# EAGLE design Main (EAGLE 9.5.1)

## Sheet 1 of 2
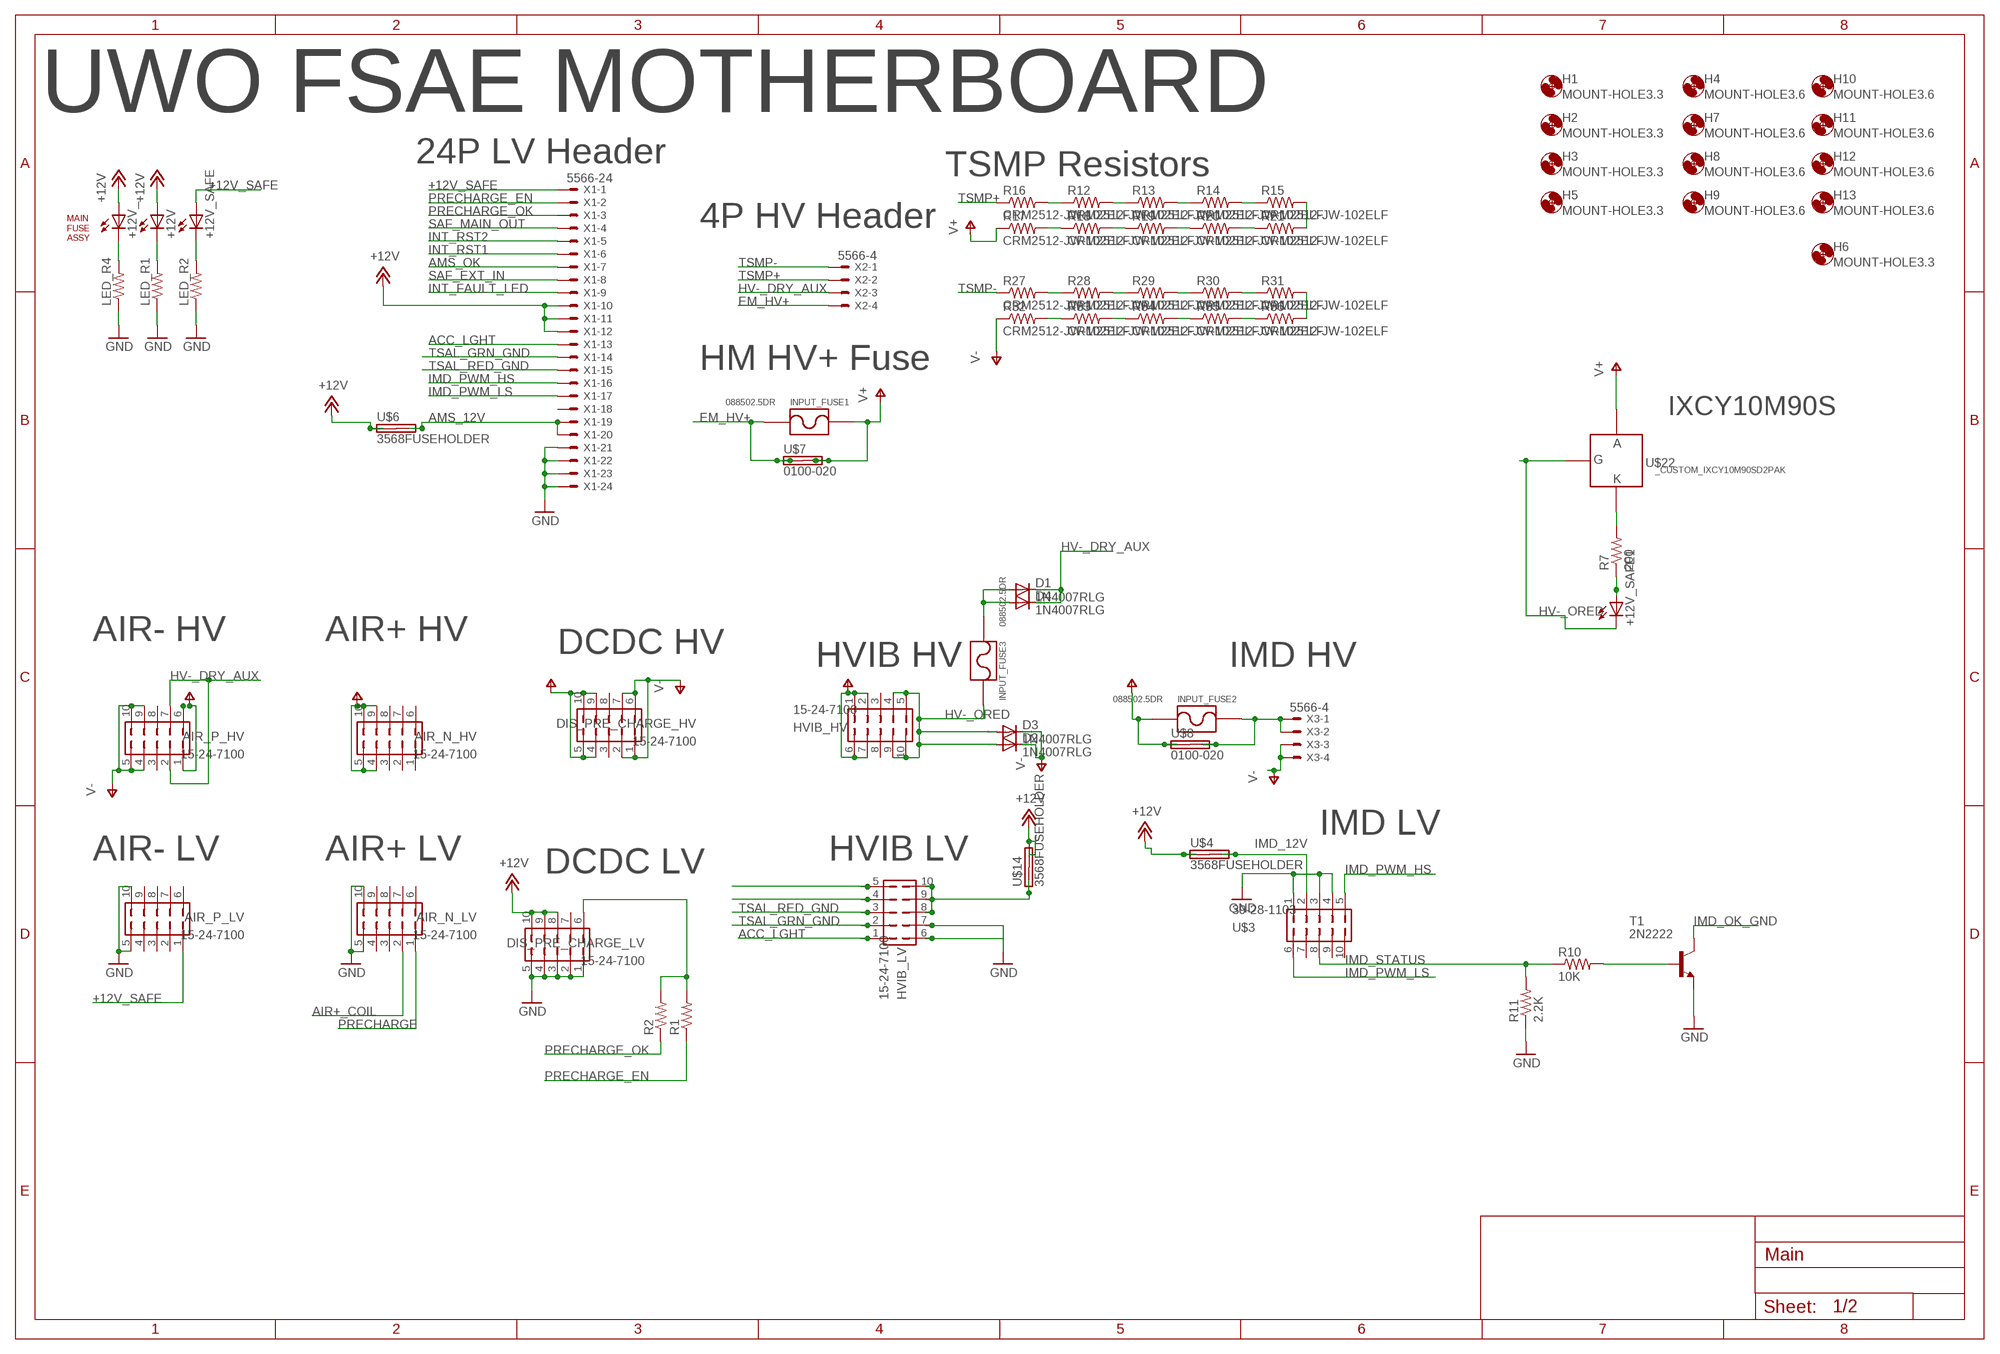
[diagram p0: schematic, sheet 1]

### Parts
+12V  LEDCHIP-LED0805  [CHIP-LED0805]
+12V_  LEDCHIP-LED0805  [CHIP-LED0805]
+12V_SAFE  LEDCHIP-LED0805  [CHIP-LED0805]
+12V_SAFE1  LED5MM  [LED5MM]
AIR_N_HV  15-24-7100  [5566-10-BMI]
AIR_N_LV  15-24-7100  [5566-10-BMI]
AIR_P_HV  15-24-7100  [5566-10-BMI]
AIR_P_LV  15-24-7100  [5566-10-BMI]
D1  1N4007RLG  1N4004  [DO41-10]
D2  1N4007RLG  1N4004  [DO41-10]
D3  1N4007RLG  1N4004  [DO41-10]
D4  1N4007RLG  1N4004  [DO41-10]
DIS_PRE_CHARGE_HV  15-24-7100  [5566-10-BMI]
DIS_PRE_CHARGE_LV  15-24-7100  [5566-10-BMI]
H1  MOUNT-HOLE3.3  [3,3]
H2  MOUNT-HOLE3.3  [3,3]
H3  MOUNT-HOLE3.3  [3,3]
H4  MOUNT-HOLE3.6  [3,6]
H5  MOUNT-HOLE3.3  [3,3]
H6  MOUNT-HOLE3.3  [3,3]
H7  MOUNT-HOLE3.6  [3,6]
H8  MOUNT-HOLE3.6  [3,6]
H9  MOUNT-HOLE3.6  [3,6]
H10  MOUNT-HOLE3.6  [3,6]
H11  MOUNT-HOLE3.6  [3,6]
H12  MOUNT-HOLE3.6  [3,6]
H13  MOUNT-HOLE3.6  [3,6]
HVIB_HV  15-24-7100  [5566-10-BMI]
HVIB_LV  15-24-7100  [5566-10-BMI]
INPUT_FUSE1  088502.5DR  _CUSTOM_PARTS_LF_885  [_CUSTOM_PARTS_LF_885]
INPUT_FUSE2  088502.5DR  _CUSTOM_PARTS_LF_885  [_CUSTOM_PARTS_LF_885]
INPUT_FUSE3  088502.5DR  _CUSTOM_PARTS_LF_885  [_CUSTOM_PARTS_LF_885]
LED_R1  R-US_R0805  [R0805]
LED_R2  R-US_R0805  [R0805]
LED_R4  R-US_R0805  [R0805]
R1  R-US_R0805  [R0805]
R2  R-US_R0805  [R0805]
R7  200  R-US_R2010  [R2010]
R10  10K  R-US_M0805  [M0805]
R11  2.2K  R-US_M0805  [M0805]
R12  CRM2512-JW-102ELF  R-US_R2512  [R2512]
R13  CRM2512-JW-102ELF  R-US_R2512  [R2512]
R14  CRM2512-JW-102ELF  R-US_R2512  [R2512]
R15  CRM2512-JW-102ELF  R-US_R2512  [R2512]
R16  CRM2512-JW-102ELF  R-US_R2512  [R2512]
R17  CRM2512-JW-102ELF  R-US_R2512  [R2512]
R18  CRM2512-JW-102ELF  R-US_R2512  [R2512]
R19  CRM2512-JW-102ELF  R-US_R2512  [R2512]
R20  CRM2512-JW-102ELF  R-US_R2512  [R2512]
R21  CRM2512-JW-102ELF  R-US_R2512  [R2512]
R27  CRM2512-JW-102ELF  R-US_R2512  [R2512]
R28  CRM2512-JW-102ELF  R-US_R2512  [R2512]
R29  CRM2512-JW-102ELF  R-US_R2512  [R2512]
R30  CRM2512-JW-102ELF  R-US_R2512  [R2512]
R31  CRM2512-JW-102ELF  R-US_R2512  [R2512]
R32  CRM2512-JW-102ELF  R-US_R2512  [R2512]
R33  CRM2512-JW-102ELF  R-US_R2512  [R2512]
R34  CRM2512-JW-102ELF  R-US_R2512  [R2512]
R35  CRM2512-JW-102ELF  R-US_R2512  [R2512]
R36  CRM2512-JW-102ELF  R-US_R2512  [R2512]
T1  2N2222  [TO92-EBC-OVAL]
U$1  MAINFUSEASSY  [MAINFUSEASSY]
U$3  39-28-1103  [39-28-1103]
U$4  3568FUSEHOLDER  [3568]
U$6  3568FUSEHOLDER  [3568]
U$7  0100-020  [0100-020]
U$8  0100-020  [0100-020]
U$14  3568FUSEHOLDER  [3568]
U$22  _CUSTOM_IXCY10M90SD2PAK  [TO228P991X238-3]
X1  5566-24  [5566-24]
X2  5566-4  [5566-4]
X3  5566-4  [5566-4]

### Nets
+12V: +12V.A +12V_.A DIS_PRE_CHARGE_LV.8 DIS_PRE_CHARGE_LV.9 DIS_PRE_CHARGE_LV.10 U$4.L1(1A) U$4.L2(1B) U$6.L1(1A) U$6.L2(1B) U$14.R1(2A) U$14.R2(2B) X1.10 X1.11 X1.12 ; also sheet 2
+12V_SAFE: +12V_SAFE.A AIR_P_LV.1 X1.1 ; also sheet 2
ACC_LGHT: HVIB_LV.1 X1.13
AIR+_COIL: AIR_N_LV.2 ; also sheet 2
AMS_12V: U$6.R1(2A) U$6.R2(2B) X1.19 X1.20
AMS_OK: X1.7 ; also sheet 2
EM_HV+ [HV]: INPUT_FUSE1.P$1 U$7.P$1(1A) U$7.P$3(1B) X2.4
GND: AIR_N_LV.5 AIR_N_LV.10 AIR_P_LV.5 AIR_P_LV.10 DIS_PRE_CHARGE_LV.1 DIS_PRE_CHARGE_LV.2 DIS_PRE_CHARGE_LV.3 DIS_PRE_CHARGE_LV.4 DIS_PRE_CHARGE_LV.5 HVIB_LV.7 LED_R1.1 LED_R2.1 LED_R4.1 R11.1 T1.E U$3.1 U$3.3 U$3.4 X1.21 X1.22 X1.23 X1.24 ; also sheet 2
HV-_DRY_AUX [HV]: AIR_P_HV.2 AIR_P_HV.7 D1.C D4.C X2.3
HV-_ORED [HV]: +12V_SAFE1.K(C) D2.A D3.A HVIB_HV.4 HVIB_HV.5 HVIB_HV.9 HVIB_HV.10 INPUT_FUSE3.P$2 U$22.1(G)
IMD_12V: U$3.2 U$4.R1(2A) U$4.R2(2B)
IMD_OK_GND: T1.C ; also sheet 2
IMD_PWM_HS: U$3.5 X1.16
IMD_PWM_LS: U$3.6 X1.17
IMD_STATUS: R10.1 R11.2 U$3.8
INT_FAULT_LED: X1.9 ; also sheet 2
INT_RST1: X1.6 ; also sheet 2
INT_RST2: X1.5 ; also sheet 2
N$1: HVIB_LV.6
N$2: +12V.C LED_R1.2
N$3: R10.2 T1.B
N$5: +12V_.C LED_R4.2
N$6: +12V_SAFE.C LED_R2.2
N$10: R12.1 R16.2
N$12: HVIB_LV.4
N$16: HVIB_LV.5
N$17: R12.2 R13.1
N$18: R13.2 R14.1
N$19: R14.2 R15.1
N$20 [HV]: R15.2 R21.2
N$21 [HV]: R20.2 R21.1
N$22 [HV]: R19.2 R20.1
N$23 [HV]: R18.2 R19.1
N$24 [HV]: R17.2 R18.1
N$25: DIS_PRE_CHARGE_LV.6 R1.2 R2.2
N$26: INPUT_FUSE2.P$2 U$8.P$2(2A) U$8.P$4(2B) X3.1 X3.2
N$31 [HV]: R7.2 U$22.2(K)
N$32 [HV]: R27.2 R28.1
N$33 [HV]: R28.2 R29.1
N$34 [HV]: R29.2 R30.1
N$35 [HV]: R30.2 R31.1
N$36 [HV]: R31.2 R36.2
N$37 [HV]: R35.2 R36.1
N$38 [HV]: R34.2 R35.1
N$39 [HV]: R33.2 R34.1
N$40 [HV]: R32.2 R33.1
N$41 [HV]: +12V_SAFE1.A R7.1
N$42: HVIB_LV.8 HVIB_LV.9 HVIB_LV.10 U$14.L1(1A) U$14.L2(1B)
N$44 [HV]: D1.A D4.A INPUT_FUSE3.P$1
PRECHARGE: AIR_N_LV.1 ; also sheet 2
PRECHARGE_EN: R1.1 X1.2 ; also sheet 2
PRECHARGE_OK: R2.1 X1.3 ; also sheet 2
SAF_EXT_IN: X1.8 ; also sheet 2
SAF_MAIN_OUT: X1.4 ; also sheet 2
TSAL_GRN_GND: HVIB_LV.2 X1.14
TSAL_RED_GND: HVIB_LV.3 X1.15
TSMP+ [HV]: R16.1 X2.2
TSMP- [HV]: R27.1 X2.1
V+ [HV]: AIR_N_HV.4 AIR_N_HV.5 AIR_N_HV.9 AIR_N_HV.10 AIR_P_HV.1 AIR_P_HV.6 DIS_PRE_CHARGE_HV.4 DIS_PRE_CHARGE_HV.5 DIS_PRE_CHARGE_HV.9 DIS_PRE_CHARGE_HV.10 HVIB_HV.1 HVIB_HV.2 HVIB_HV.6 HVIB_HV.7 INPUT_FUSE1.P$2 INPUT_FUSE2.P$1 R17.1 U$7.P$2(2A) U$7.P$4(2B) U$8.P$1(1A) U$8.P$3(1B) U$22.3(A)
V- [HV]: AIR_P_HV.4 AIR_P_HV.5 AIR_P_HV.9 AIR_P_HV.10 D2.C D3.C DIS_PRE_CHARGE_HV.1 DIS_PRE_CHARGE_HV.2 DIS_PRE_CHARGE_HV.6 DIS_PRE_CHARGE_HV.7 R32.1 X3.3 X3.4
Unconnected: AIR_N_HV.1 AIR_N_HV.2 AIR_N_HV.3 AIR_N_HV.6 AIR_N_HV.7 AIR_N_HV.8 AIR_N_LV.3 AIR_N_LV.4 AIR_N_LV.6 AIR_N_LV.7 AIR_N_LV.8 AIR_N_LV.9 AIR_P_HV.3 AIR_P_HV.8 AIR_P_LV.2 AIR_P_LV.3 AIR_P_LV.4 AIR_P_LV.6 AIR_P_LV.7 AIR_P_LV.8 AIR_P_LV.9 DIS_PRE_CHARGE_HV.3 DIS_PRE_CHARGE_HV.8 DIS_PRE_CHARGE_LV.7 HVIB_HV.3 HVIB_HV.8 U$3.7 U$3.9 U$3.10 X1.18

### Notes on the sheet
- UWO FSAE MOTHERBOARD
- 24P LV Header
- TSMP Resistors
- 4P HV Header
- HM HV+ Fuse
- IXCY10M90S
- AIR- HV | AIR+ HV
- DCDC HV
- HVIB HV | IMD HV
- IMD LV
- AIR- LV | AIR+ LV | HVIB LV
- DCDC LV

## Sheet 2 of 2
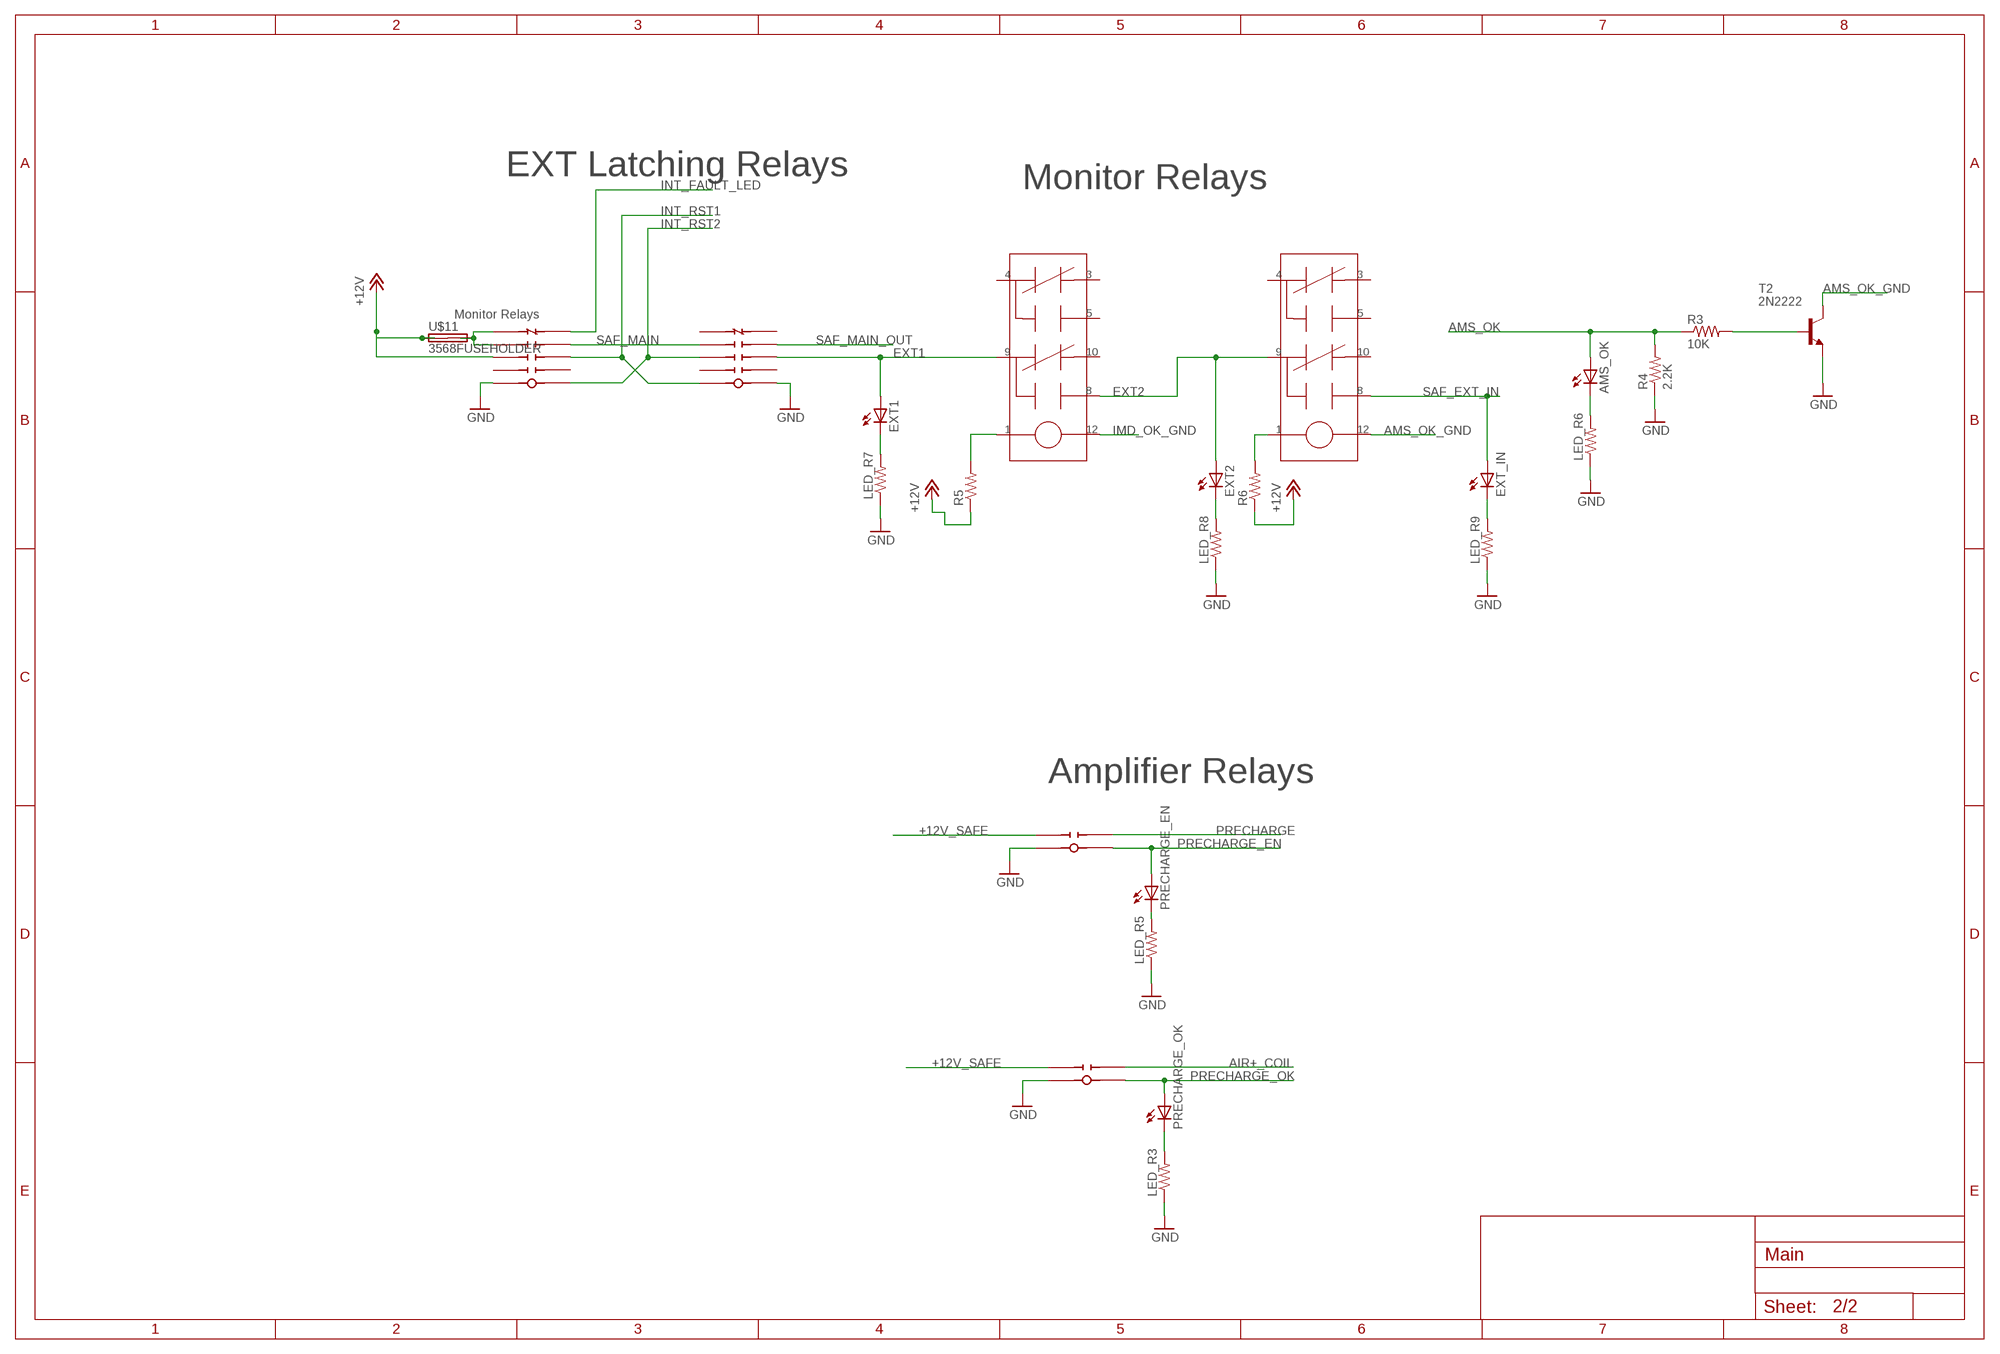
[diagram p1: schematic, sheet 2]

### Parts
AMS_OK  LEDCHIP-LED0805  [CHIP-LED0805]
EXT1  LEDCHIP-LED0805  [CHIP-LED0805]
EXT2  LEDCHIP-LED0805  [CHIP-LED0805]
EXT_IN  LEDCHIP-LED0805  [CHIP-LED0805]
LED_R3  R-US_R0805  [R0805]
LED_R5  R-US_R0805  [R0805]
LED_R6  R-US_R0805  [R0805]
LED_R7  R-US_R0805  [R0805]
LED_R8  R-US_R0805  [R0805]
LED_R9  R-US_R0805  [R0805]
PRECHARGE_EN  LEDCHIP-LED0805  [CHIP-LED0805]
PRECHARGE_OK  LEDCHIP-LED0805  [CHIP-LED0805]
R3  10K  R-US_M0805  [M0805]
R4  2.2K  R-US_M0805  [M0805]
R5  R-US_R0805  [R0805]
R6  R-US_R0805  [R0805]
T2  2N2222  [TO92-EBC-OVAL]
U$2  SR4M4012_TE  [SR4M4012_FOOT]
U$5  SR4M4012_TE  [SR4M4012_FOOT]
U$9  G5NB-1A-E  [G5NB-1A-E]
U$10  G5NB-1A-E  [G5NB-1A-E]
U$11  3568FUSEHOLDER  [3568]
U$12  V23079B1203B301  [V23079B1203B301]
U$13  V23079B1203B301  [V23079B1203B301]

### Nets
+12V: R5.1 R6.1 U$2.NOA2 U$11.L1(1A) U$11.L2(1B) ; also sheet 1
+12V_SAFE: U$9.2(NOA1) U$10.2(NOA1) ; also sheet 1
AIR+_COIL: U$9.3(NOB1) ; also sheet 1
AMS_OK: AMS_OK.A R3.1 R4.2 ; also sheet 1
AMS_OK_GND: T2.C U$13.12
EXT1: EXT1.A U$5.NOB2 U$12.9
EXT2: EXT2.A U$12.8 U$13.9
GND: LED_R3.1 LED_R5.1 LED_R6.1 LED_R7.1 LED_R8.1 LED_R9.1 R4.1 T2.E U$2.COIL+ U$5.COIL- U$9.1(COIL+) U$10.1(COIL+) ; also sheet 1
IMD_OK_GND: U$12.12 ; also sheet 1
INT_FAULT_LED: U$2.NCB4 ; also sheet 1
INT_RST1: U$2.NOB2 U$5.COIL+ ; also sheet 1
INT_RST2: U$2.COIL- U$5.NOA2 ; also sheet 1
N$4: U$2.NCA4 U$2.NOA3 U$11.R1(2A) U$11.R2(2B)
N$7: LED_R5.2 PRECHARGE_EN.C
N$8: LED_R3.2 PRECHARGE_OK.C
N$11: AMS_OK.C LED_R6.2
N$13: EXT1.C LED_R7.2
N$14: EXT2.C LED_R8.2
N$15: EXT_IN.C LED_R9.2
N$27: R3.2 T2.B
N$29: R5.2 U$12.1
N$30: R6.2 U$13.1
PRECHARGE: U$10.3(NOB1) ; also sheet 1
PRECHARGE_EN: PRECHARGE_EN.A U$10.4(COIL-) ; also sheet 1
PRECHARGE_OK: PRECHARGE_OK.A U$9.4(COIL-) ; also sheet 1
SAF_EXT_IN: EXT_IN.A U$13.8 ; also sheet 1
SAF_MAIN: U$2.NOB3 U$5.NOA3
SAF_MAIN_OUT: U$5.NOB3 ; also sheet 1
Unconnected: U$2.NOA1 U$2.NOB1 U$5.NCA4 U$5.NCB4 U$5.NOA1 U$5.NOB1 U$12.3 U$12.4 U$12.5 U$12.10 U$13.3 U$13.4 U$13.5 U$13.10

### Notes on the sheet
- EXT Latching Relays
- Monitor Relays
- Monitor Relays
- Amplifier Relays

## Library data of the parts
+12V +12V_ +12V_SAFE +12V_SAFE1 AMS_OK EXT1 EXT2 EXT_IN PRECHARGE_EN PRECHARGE_OK = ACC-MB-R0:LED: LED OSRAM: - CHIPLED LG R971, LG N971, LY N971, LG Q971, LY Q971, LO R971, LY R971 LH N974, LH R974 LS Q976, LO Q976, LY Q976 LO Q996 - Hyper CHIPLED LW Q18S LB Q993, LB Q99A, LB R99A - SideLED LS A670, LO A670, LY A670, LG A670, LP A670 LB A673, LV A673, LT A673, LW A673 LH A674 LY A675 LS A676, LA A676, LO A676, LY A676, LW A676 LS A679, LY A679, LG A679 - Hyper Micro SIDELED® LS Y876, LA Y876, LO Y876, LY Y876 LT Y87S - SmartLED LW L88C, LW L88S LB L89C, LB L89S, LG L890 LS L89K, LO L89K, LY L89K LS L896, LA L896, LO L896, LY L896 - TOPLED LS T670, LO T670, LY T670, LG T670, LP T670 LSG T670, LSP T670, LSY T670, LOP T670, LYG T670 LG T671, LOG T671, LSG T671 LB T673, LV T673, LT T673, LW T673 LH T674 LS T676, LA T676, LO T676, LY T676, LB T676, LH T676, LSB T676, LW T676 LB T67C, LV T67C, LT T67C, LS T67K, LO T67K, LY T67K, LW E67C LS E67B, LA E67B, LO E67B, LY E67B, LB E67C, LV E67C, LT E67C LW T67C LS T679, LY T679, LG T679 LS T770, LO T770, LY T770, LG T770, LP T770 LB T773, LV T773, LT T773, LW T773 LH T774 LS E675, LA E675, LY E675, LS T675 LS T776, LA T776, LO T776, LY T776, LB T776 LHGB T686 LT T68C, LB T68C - Hyper Mini TOPLED® LB M676 - Mini TOPLED Santana® LG M470 LS M47K, LO M47K, LY M47K Source: http://www.osram.convergy.de LUXEON: - LUMILED® LXK2-PW12-R00, LXK2-PW12-S00, LXK2-PW14-U00, LXK2-PW14-V00 LXK2-PM12-R00, LXK2-PM12-S00, LXK2-PM14-U00 LXK2-PE12-Q00, LXK2-PE12-R00, LXK2-PE12-S00, LXK2-PE14-T00, LXK2-PE14-U00 LXK2-PB12-K00, LXK2-PB12-L00, LXK2-PB12-M00, LXK2-PB14-N00, LXK2-PB14-P00, LXK2-PB14-Q00 LXK2-PR12-L00, LXK2-PR12-M00, LXK2-PR14-Q00, LXK2-PR14-R00 LXK2-PD12-Q00, LXK2-PD12-R00, LXK2-PD12-S00 LXK2-PH12-R00, LXK2-PH12-S00 LXK2-PL12-P00, LXK2-PL12-Q00, LXK2-PL12-R00 Source: www.luxeon.com KINGBRIGHT: KA-3528ASYC Source: www.kingbright.com
AIR_N_HV AIR_N_LV AIR_P_HV AIR_P_LV DIS_PRE_CHARGE_HV DIS_PRE_CHARGE_LV HVIB_HV HVIB_LV = ACC-MB-R0:15-24-7100
D1-D4 = ACC-MB-R0:1N4004: DIODE general purpose rectifier, 1 A
H1-H13 = ACC-MB-R0:MOUNT-HOLE: MOUNTING HOLE with drill center marker
INPUT_FUSE1-INPUT_FUSE3 = ACC-MB-R0:_CUSTOM_PARTS_LF_885
LED_R1-LED_R9 R1-R6 R10-R21 R27-R36 = ACC-MB-R0:R-US_: RESISTOR, American symbol; SPICEPREFIX: R
R7 = Main:R-US_: RESISTOR, American symbol; SPICEPREFIX: R
T1 T2 = adafruit:2N2222: NPN TRANSISTOR Big oval pads
U$1 = ACC-MB-R0:MAINFUSEASSY
U$2 U$5 = ACC-MB-R0:SR4M4012_TE
U$3 = ACC-MB-R0:39-28-1103
U$4 U$6 U$11 U$14 = ACC-MB-R0:3568FUSEHOLDER: 3568 20AMP 500VAC
U$7 U$8 = ACC-MB-R0:0100-020
U$9 U$10 = ACC-MB-R0:G5NB-1A-E
U$12 U$13 = ACC-MB-R0:V23079B1203B301
U$22 = Main:_CUSTOM_IXCY10M90S
X1 = ACC-MB-R0:5566-24: Mini FIT connector 24 pol Source: http://www.molex.com; MF: MOLEX; OC_FARNELL: unknown; OC_NEWARK: unknown
X2 X3 = ACC-MB-R0:5566-4: Mini FIT connector 4 pol Source: http://www.molex.com; MF: MOLEX; OC_FARNELL: unknown; OC_NEWARK: unknown

## Net classes
0 default: width 0.2 mm, clearance 0.21 mm
2 HV: width 1.27 mm, clearance 1.6 mm to class 0, clearance 1.6 mm to class 1, clearance 1.6 mm

## Board
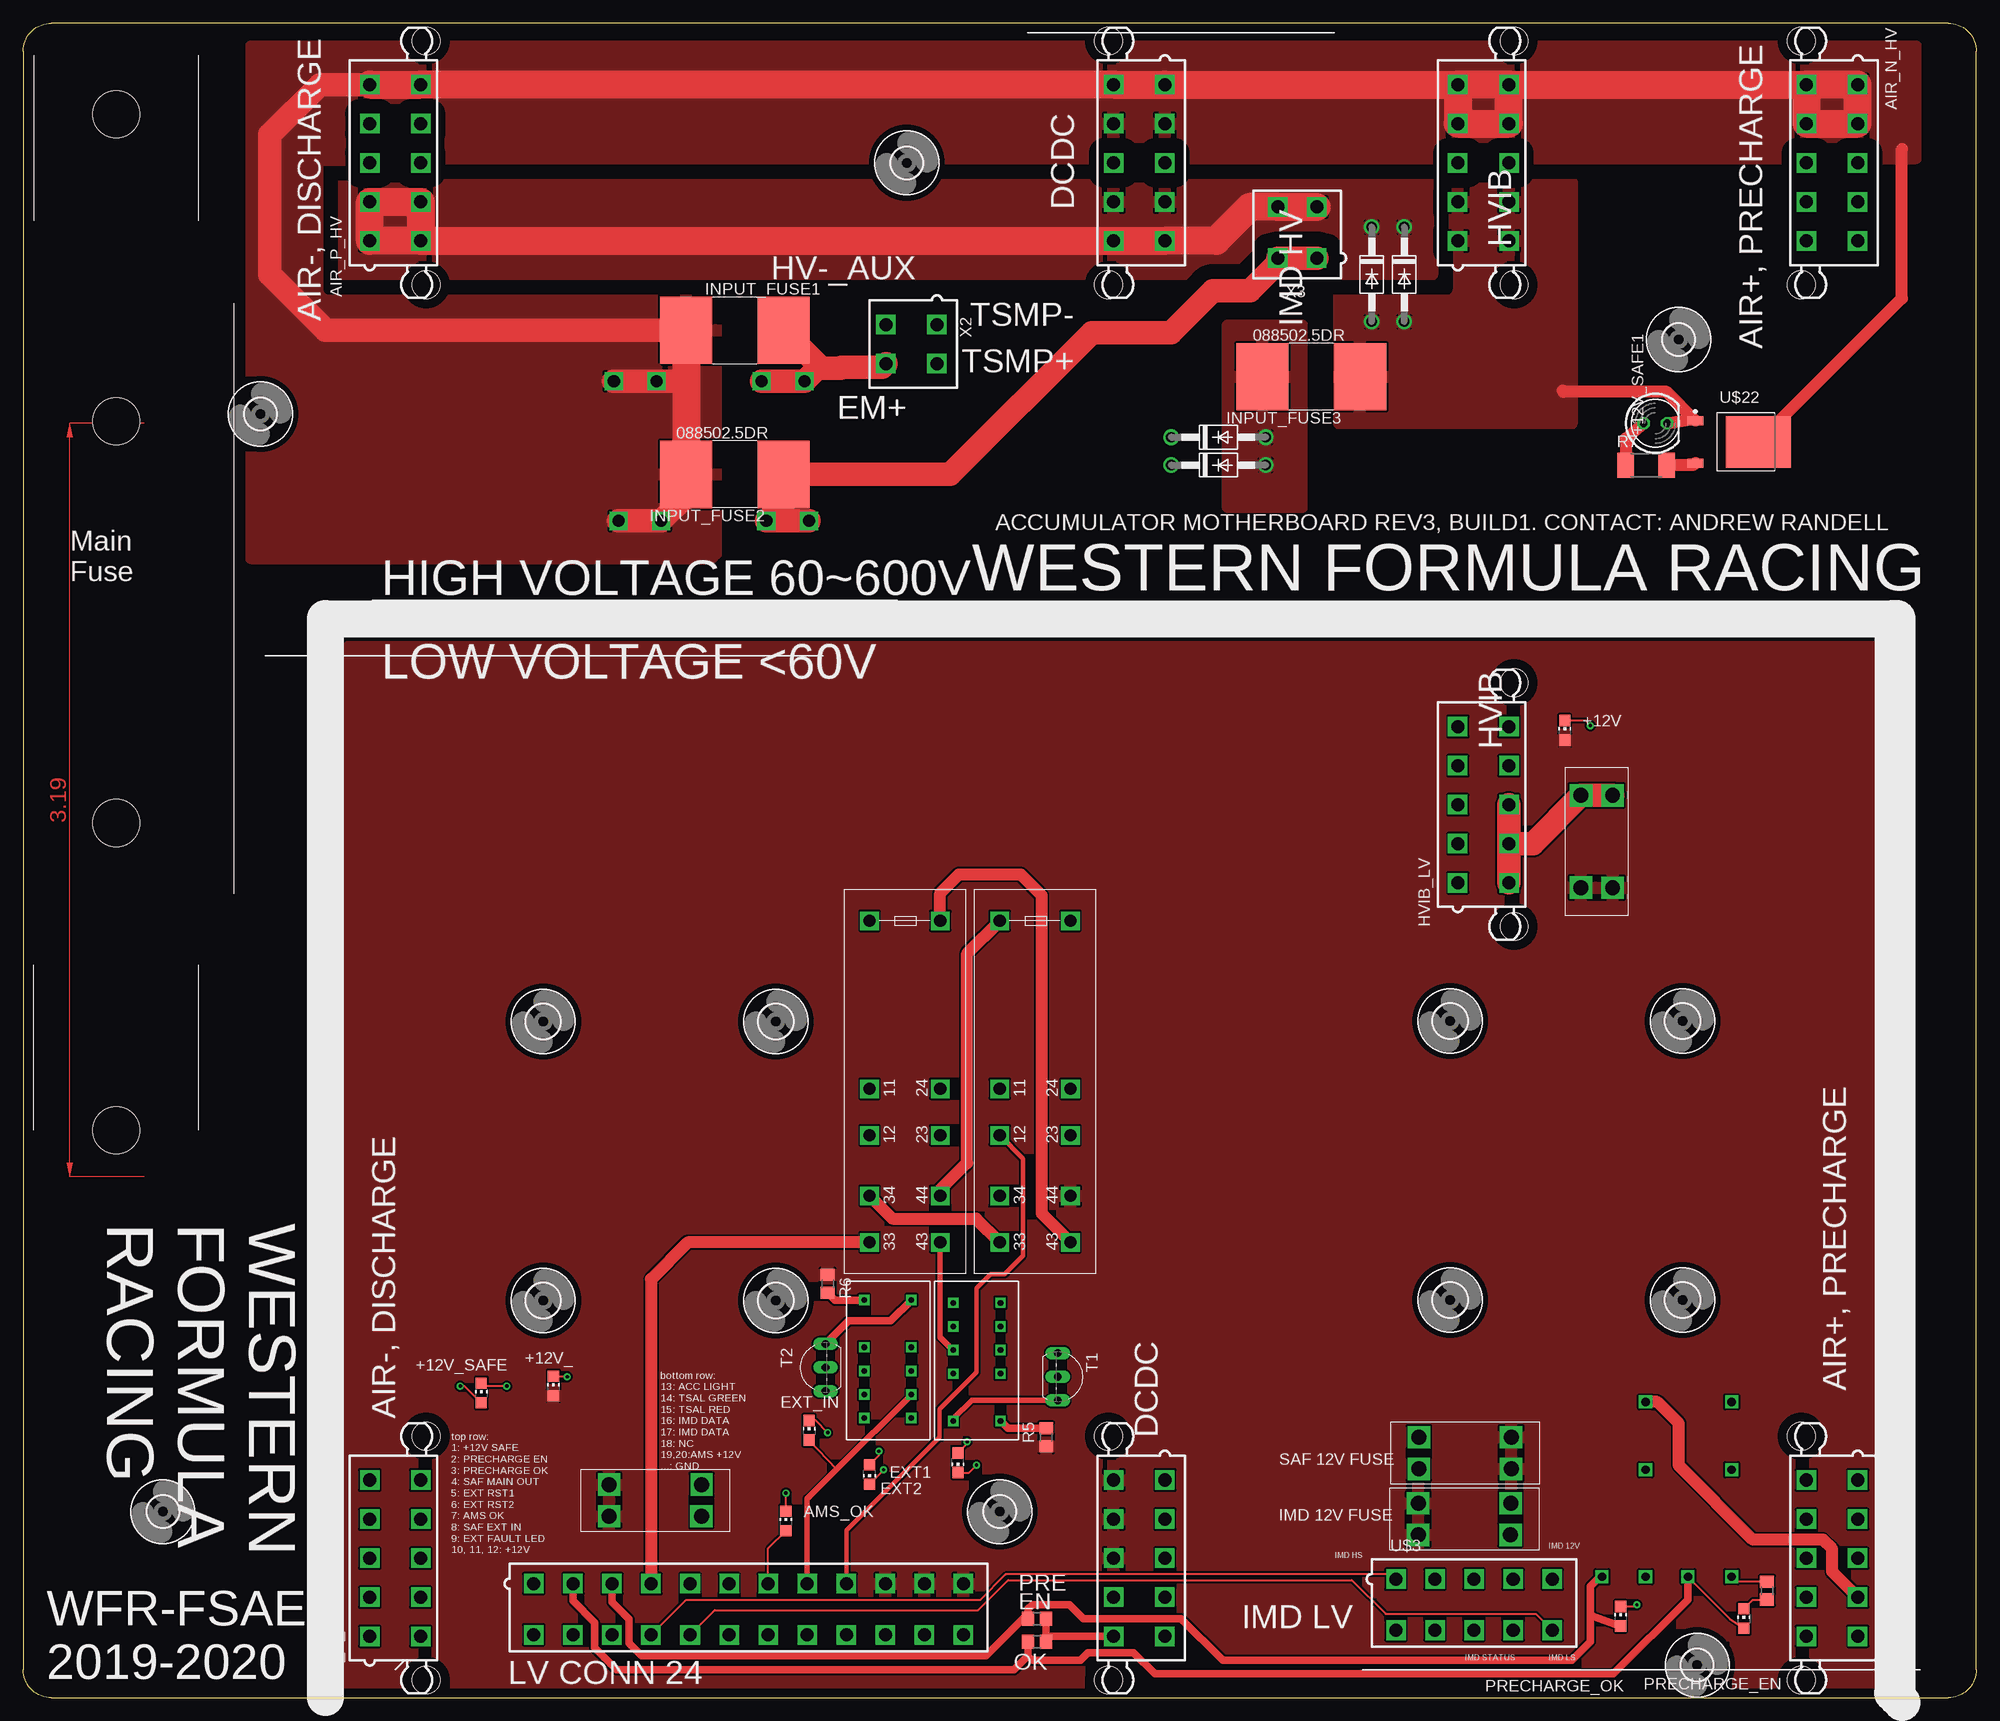
[diagram p2: board, top side]
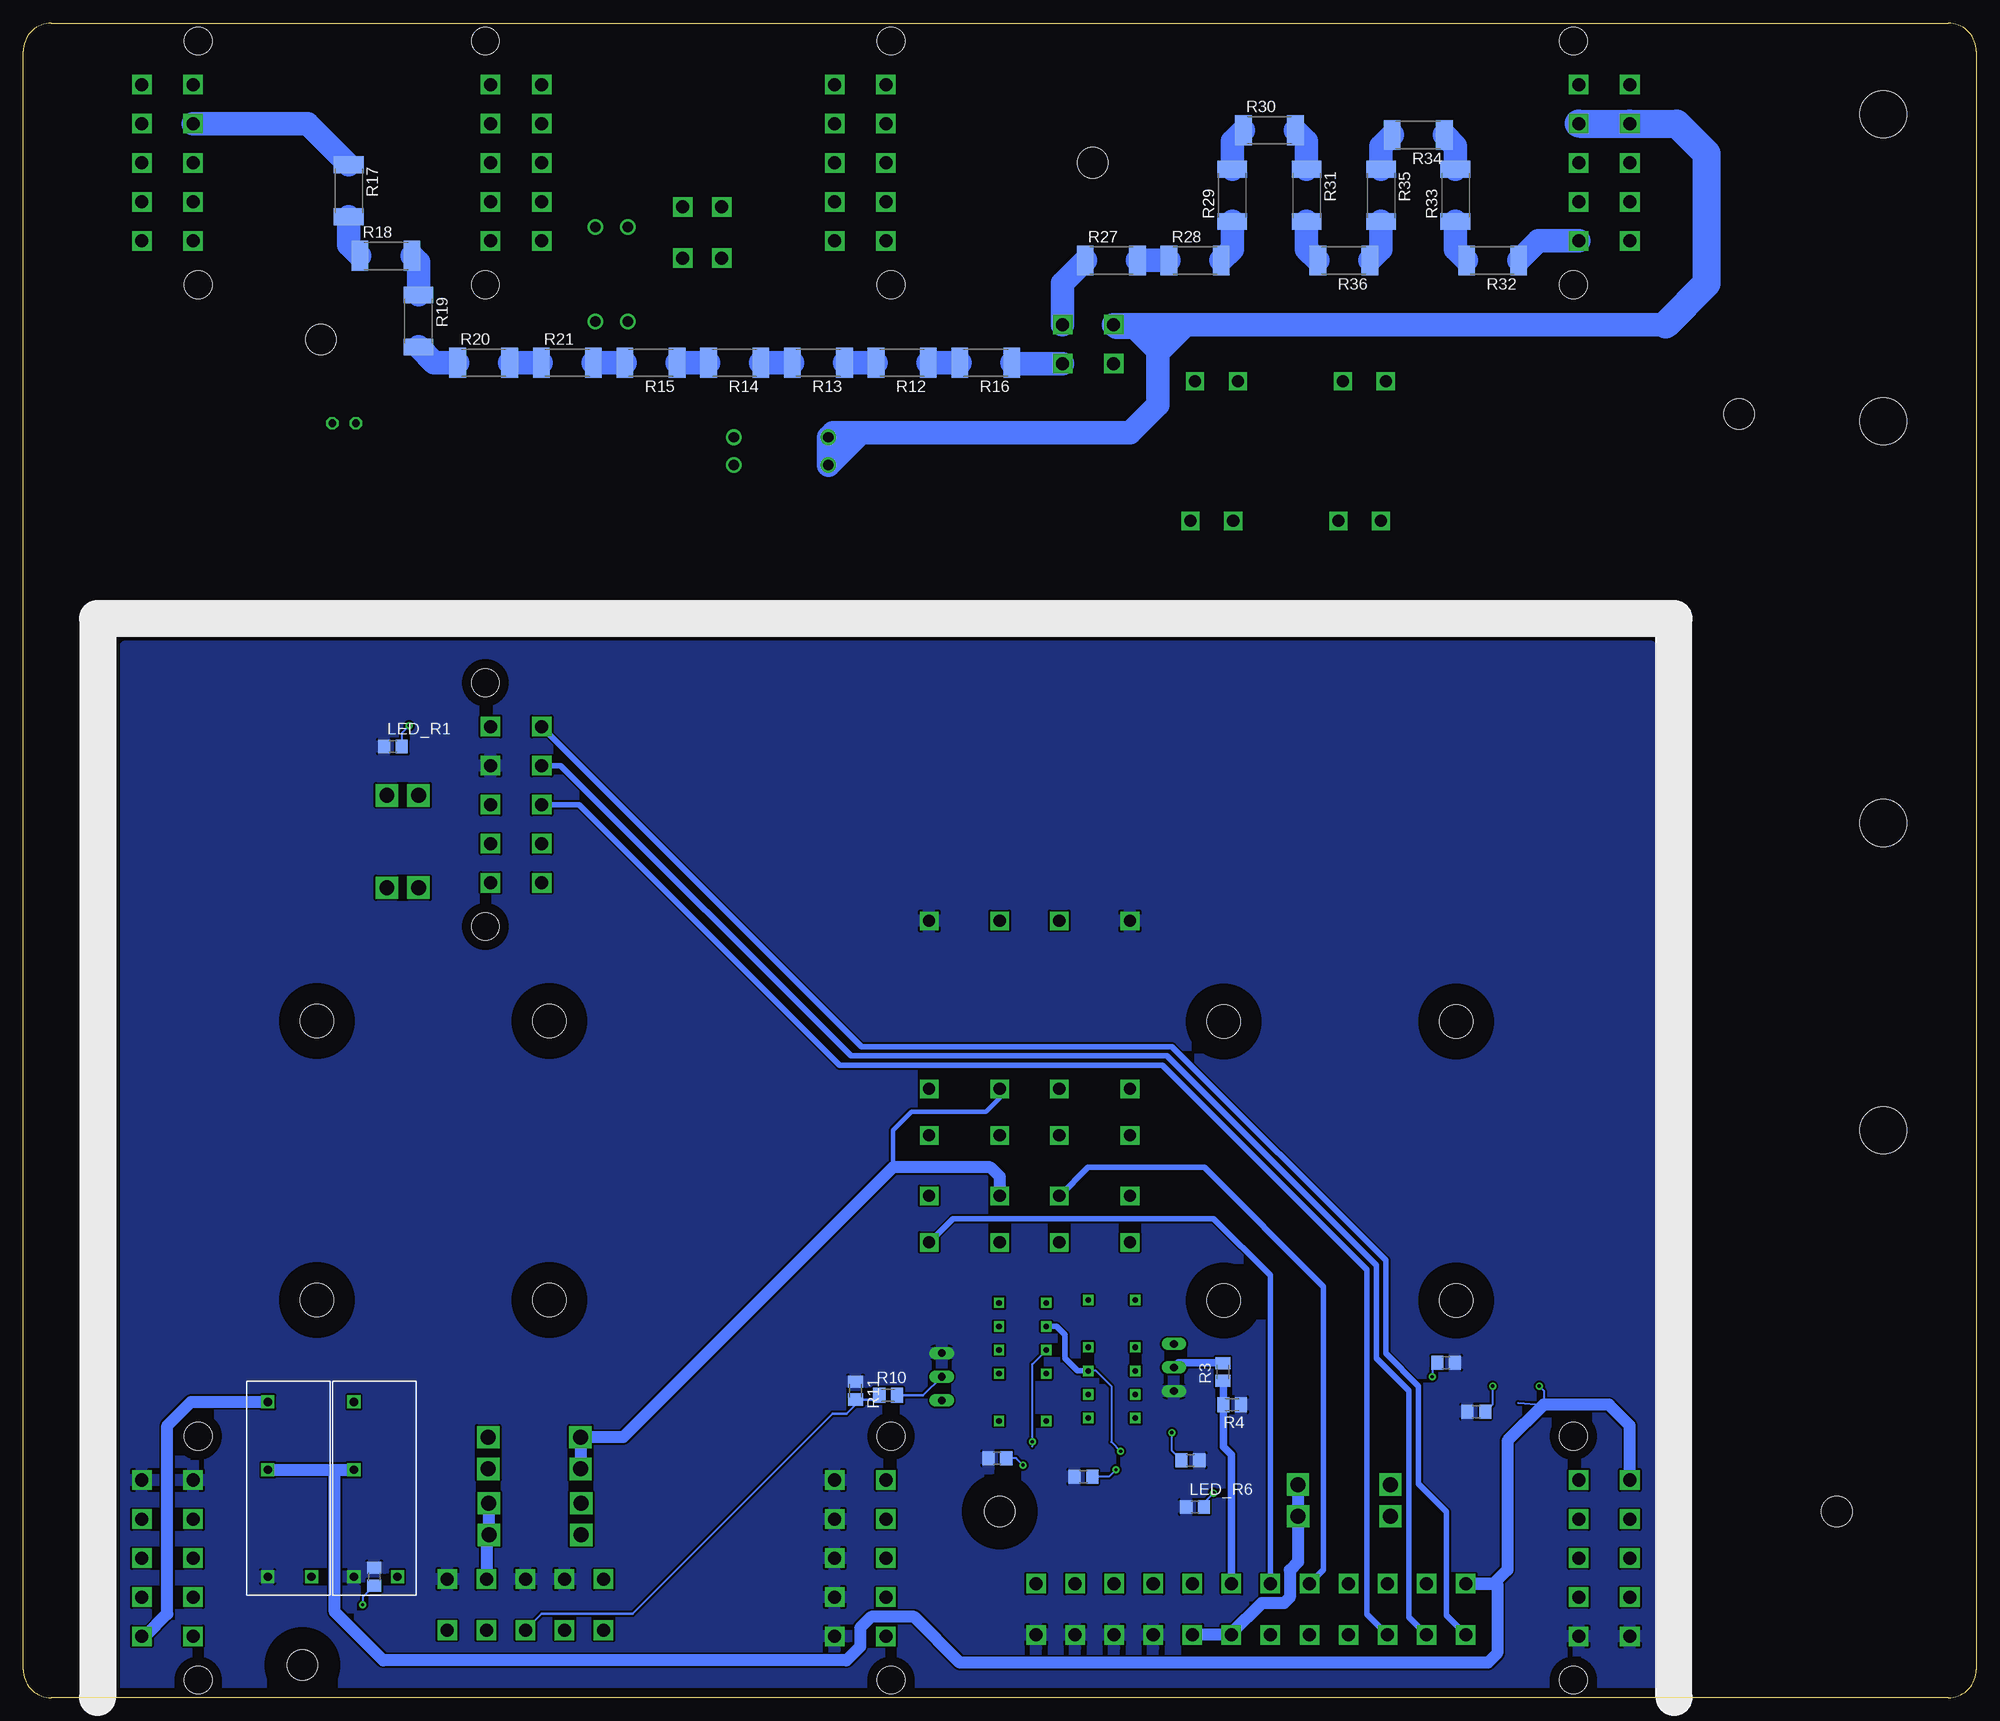
[diagram p3: board, bottom side, seen from below]

Size 210 x 180 mm. Coordinates in mm from the lower left corner, seen from the top.
Outline: 3,0 207,0 arc90 210,3 210,177 arc90 207,180 3,180 arc90 0,177 0,3 arc90 3,0
Copper layers (1*16): Top 0.035mm / dielectric 1.5mm / Bottom 0.035mm
Design rules "default": minimum track width 6mil, minimum drill 0.35mm, track to track 6mil, track to pad 6mil, pad to pad 6mil, via to via 6mil, smd to smd 6mil, copper to edge 40mil, drill to drill 6mil, minimum pad ring 10mil, minimum via ring 8mil, stop-mask expansion 4mil, vias tented up to drill 0mil, thermal gap 10mil

### Footprints (pad centres in the part's own frame; a part is rotated, then mirrored left to right if it is on the bottom)
CHIP-LED0805 = smd 1.2 x 1.2: A 0,-1.05; C 0,1.05
LED5MM = drill 0.813 octagon: A -1.27,0; K 1.27,0
5566-10-BMI = drill 1.4 square: 1 -8.4,-2.75; 2 -4.2,-2.75; 3 0,-2.75; 4 4.2,-2.75; 5 8.4,-2.75; 6 -8.4,2.75; 7 -4.2,2.75; 8 0,2.75; 9 4.2,2.75; 10 8.4,2.75 | hole 3: 13.1,3.31; -13.1,3.31
DO41-10 = drill 1.118: A 5.08,0; C -5.08,0
3,3 = hole 3.3: 0,0
3,6 = hole 3.6: 0,0
_CUSTOM_PARTS_LF_885 = smd 5.6 x 7.23: P$1 5.25,0; P$2 -5.25,0
R0805 = smd 1.3 x 1.5: 1 -0.95,0; 2 0.95,0
M0805 = smd 1.3 x 1.6: 1 -0.95,0; 2 0.95,0
R2010 = smd 1.8 x 2.7: 1 -2.2,0; 2 2.2,0
R2512 = smd 1.8 x 3.2: 1 -2.8,0; 2 2.8,0
TO92-EBC-OVAL = drill 0.813 long: B 0,-1.27; C 2.54,-1.27; E -2.54,-1.27
MAINFUSEASSY = hole 5.08: 0,0; 76.2,0; 33.02,0; 109.22,0
SR4M4012_FOOT = drill 1.3 pad 2 square: COIL+ 0,7.6; COIL- 0,0; NCA4 18.05,0; NCB4 23.05,0; NOA1 18.05,7.6; NOA2 29.55,7.6; NOA3 29.55,0; NOB1 23.05,7.6; NOB2 34.55,7.6; NOB3 34.55,0
39-28-1103 = drill 1.4 square: 1 -8.4,-2.75; 2 -4.2,-2.75; 3 0,-2.75; 4 4.2,-2.75; 5 8.4,-2.75; 6 -8.4,2.75; 7 -4.2,2.75; 8 0,2.75; 9 4.2,2.75; 10 8.4,2.75
3568 = drill 1.6 square: L1 0,3.4; L2 0,0; R1 9.94,3.4; R2 9.92,0
0100-020 = drill 1.3 square: P$1 0,0; P$2 15.9,0; P$3 4.6,0; P$4 20.5,0
G5NB-1A-E = drill 0.9 square: 1 0,4.7; 2 11.5,4.7; 3 18.8,4.7; 4 0,0
V23079B1203B301 = drill 0.6 square: 1 0,-5.08; 3 5.08,-5.08; 4 7.62,-5.08; 5 10.16,-5.08; 6 12.7,-5.08; 7 12.7,0; 8 10.16,0; 9 7.62,0; 10 5.08,0; 12 0,0
TO228P991X238-3 = smd 1.718 x 0.974: 1 -4.704,2.28; 2 -4.704,-2.28 | smd 7.001 x 5.544: 3 2.063,0
5566-24 = drill 1.4 square: 1 23.1,-2.75; 2 18.9,-2.75; 3 14.7,-2.75; 4 10.5,-2.75; 5 6.3,-2.75; 6 2.1,-2.75; 7 -2.1,-2.75; 8 -6.3,-2.75; 9 -10.5,-2.75; 10 -14.7,-2.75; 11 -18.9,-2.75; 12 -23.1,-2.75; 13 23.1,2.75; 14 18.9,2.75; 15 14.7,2.75; 16 10.5,2.75; 17 6.3,2.75; 18 2.1,2.75; 19 -2.1,2.75; 20 -6.3,2.75; 21 -10.5,2.75; 22 -14.7,2.75; 23 -18.9,2.75; 24 -23.1,2.75
5566-4 = drill 1.4 square: 1 2.1,-2.75; 2 -2.1,-2.75; 3 2.1,2.75; 4 -2.1,2.75

### Placement (x,y rotation side)
+12V  165.75,104 0 top
+12V_  57,33.5 0 top
+12V_SAFE  49.25,32.75 0 top
+12V_SAFE1  175.5,137 0 top
AIR_N_HV  194.5,165 90 top
AIR_N_LV  194.5,15 90 top
AIR_P_HV  40,165 270 top
AIR_P_LV  40,15 270 top
AMS_OK  82,19 0 top
D1  128.5,132.5 0 top
D2  148.5,153 270 top
D3  145,153 270 top
D4  128.5,135.5 0 top
DIS_PRE_CHARGE_HV  120,165 90 top
DIS_PRE_CHARGE_LV  120,15 90 top
EXT1  100.5,25.25 180 top
EXT2  91,24 180 top
EXT_IN  84.5,28.75 0 top
H1  180,3.5 0 top
H2  95,165 0 top
H3  15,20 0 top
H4  55.91,42.7 0 top
H5  25.5,138 0 top
H6  178,146 0 top
H7  55.91,72.7 0 top
H8  80.91,42.7 0 top
H9  80.91,72.7 0 top
H10  153.43,42.75 0 top
H11  153.43,72.75 0 top
H12  178.43,42.75 0 top
H13  178.43,72.75 0 top
H14  MOUNT-HOLE3.3  [3,3]  105,20 0 top
HVIB_HV  157,165 270 top
HVIB_LV  157,96 270 top
INPUT_FUSE1  76.5,147 0 top
INPUT_FUSE2  76.5,131.5 180 top
INPUT_FUSE3  138.5,142 180 top
LED_R1  170.25,102.25 0 bottom
LED_R2  53.75,30.75 0 bottom
LED_R3  172.25,13 270 bottom
LED_R4  57,36 180 bottom
LED_R5  187.5,11.5 270 top
LED_R6  84,20.5 0 bottom
LED_R7  105.25,25.75 0 bottom
LED_R8  96,23.75 0 bottom
LED_R9  84.5,25.5 180 bottom
PRECHARGE_EN  185,8.5 0 top
PRECHARGE_OK  171.75,8.75 0 top
R1  109,6 0 top
R2  109,8.5 0 top
R3  81,35 90 bottom
R4  80,31.5 180 bottom
R5  110,28 90 top
R6  86.5,44.5 270 top
R7  174.5,132.5 0 top
R10  117,32.5 0 bottom
R11  120.5,33 270 bottom
R12  115.5,143.5 180 bottom
R13  124.5,143.5 180 bottom
R14  133.5,143.5 180 bottom
R15  142.5,143.5 180 bottom
R16  106.5,143.5 180 bottom
R17  175,162 270 bottom
R18  171,155 0 bottom
R19  167.5,148 270 bottom
R20  160.5,143.5 0 bottom
R21  151.5,143.5 0 bottom
R27  93,154.5 0 bottom
R28  84,154.5 0 bottom
R29  80,161.5 90 bottom
R30  76,168.5 0 bottom
R31  72,161.5 270 bottom
R32  52,154.5 180 bottom
R33  56,161.5 90 bottom
R34  60,168 180 bottom
R35  64,161.5 270 bottom
R36  68,154.5 180 bottom
T1  112.5,34.5 270 top
T2  85,35.5 90 top
U$1  10,61 90 top
U$2  105,83.5 270 top
U$3  156,10 180 top
U$4  150,17.5 0 top
U$5  91,83.5 270 top
U$6  63,19.5 0 top
U$7  84,141.5 180 top
U$8  64,126.5 0 top
U$9  169.75,13 90 bottom
U$10  179,13 90 bottom
U$11  160,28 180 top
U$12  100,29.75 90 top
U$13  95.5,42.75 270 top
U$14  167.5,97 270 top
U$22  184.5,135 0 top
X1  78,9.5 180 top
X2  95.5,145.5 90 top
X3  137,157.5 0 top

### Tracks (layer width: path | path; a pad name or v marks a point on that pad's centre or on a via)
+12V
  pour Top: 35,113 199,113 199,-5 35,-5
+12V_SAFE  (via drill 0.35)
  Top 0.2: +12V_SAFE.A 47.45,33.5 v47,33.5
  Bottom 0.2: +12V_SAFE.A 46.73,31.5 46.5,31.5 46.5,33 v47,33.5
  Bottom 1.27: AIR_P_LV.1 37.25,29.25 39.5,31.5 46.5,31.5 50.4,27.6 50.4,13.75 51.9,12.25 X1.1 | X1.1 54.65,12 | U$10.2 176.5,24.5 | 176.5,24.5 U$9.2 | 176.5,24.5 176.5,9.22 171.28,4 121.5,4 120,5.5 120,7.5 118.81,8.69 114.19,8.69 109.28,3.78 52.5,3.78 51.5,4.78 51.5,12.25 X1.1
ACC_LGHT
  Bottom 0.61: X1.13 57,8.85 57,20 60,23 60,33.5 63.5,37 63.5,47 86.5,70 119.85,70 HVIB_LV.1
AIR+_COIL
  Top 1.27: U$9.3 175.7,31.8 178,29.5 178,25 186,17 193.5,17 194.5,16 194.5,13.55 AIR_N_LV.2
AMS_12V
  Bottom 1.27: U$6.R1 72.94,19.52 U$6.R2 72.92,14.59 73.81,13.7 73.81,10.77 74.42,10.16 76.83,10.16 80.1,6.9 X1.19 X1.20
AMS_OK
  Top 0.2: X1.7 80.1,16.05 AMS_OK.A
  Bottom 0.813: R3.1 80.95,34 R4.2 80.95,26.95 80.1,26.1 X1.7
AMS_OK_GND
  Top 0.813: T2.C 88.73,40.5 93.25,40.5 U$13.12
EM_HV+
  Top 2.54: X2.4 92.35,143 88,143 87.9,142.9 85.85,142.9 85.62,143.12 | 85.62,143.12 INPUT_FUSE1.P$1 | U$7.P$3 U$7.P$1 85.62,143.12
EXT1  (via drill 0.35)
  Top 0.2: EXT1.A 101.5,27.3 v101.5,27.5
  Top 0.61: U$5.NOB2 98.6,38.77 U$12.9
  Bottom 0.2: U$12.9 101.5,35.87 v101.5,27.5 101.5,27.02
EXT2  (via drill 0.35)
  Top 0.2: v92,26.5 92,26.05 EXT2.A
  Bottom 0.2: U$13.9 94.63,35.13 93,33.5 93,27.5 v92,26.5
  Bottom 0.61: U$12.8 98.91,39.91 98,39 98,36.5 96.63,35.13 U$13.9
GND
  Top 0.2: LED_R5.1 184.25,12.45 U$10.1
  pour Bottom: 35,113 199,113 199,-6 35,-6
HV-_DRY_AUX
  Bottom 2.54: 85,147.6 X2.3 92.47,147.32 90.51,147.32 88,144.81 | 85,147.6 33.4,147.6 | 88,144.81 88,139 91,136 119.92,136 | 88,144.81 87.79,144.81 85,147.6 | 119.92,136 122.92,136 D4.C D1.C 119.92,136
  Bottom 3: AIR_P_HV.7 AIR_P_HV.2 32.2,169.2 29,166 29,152 33.4,147.6
HV-_ORED
  Top 1.27: +12V_SAFE1.K 179.58,137.5 U$22.1 176.71,140.37 165.63,140.37 165.5,140.5
  pour Top (rank 3): 141.5,163 166.5,163 166.5,137 141.5,137
IMD_12V
  Bottom 1.27: U$4.R1 159.94,17.52 U$4.R2 160.2,17.22 U$3.2
IMD_OK_GND
  Top 0.61: U$12.12 100,30 102,32 111.19,32 T1.C
IMD_PWM_HS
  Top 0.2: U$3.5 147.1,13.25 105.64,13.25 102.88,10.49 71.24,10.49 X1.16
IMD_PWM_LS
  Top 0.2: X1.17 74.35,9.4 102.64,9.4 105.89,12.65 142.85,12.65 146.5,9 162.65,9 U$3.6
IMD_STATUS
  Bottom 0.254: U$3.8 154.25,9 144.5,9 123,30.5 121.5,30.5 120.5,31.5 R11.2 118.4,32.05 R10.1
INT_FAULT_LED
  Top 0.508: U$2.NCB4 107.5,57.95 107.5,47.5 105.5,45.5 104,45.5 102.5,44 102.5,35 98.5,31 98.5,28 88.5,18 X1.9
INT_RST1
  Top 1.27: U$5.COIL+ 98.6,86.5 100.6,88.5 107.25,88.5 109.5,86.25 109.5,52.05 U$2.NOB2
  Bottom 0.61: X1.6 75.9,45.4 82,51.5 110,51.5 112.55,48.95 U$2.NOB2
INT_RST2
  Top 1.27: U$5.NOA2 98.6,54.6 101.5,57.5 101.5,80 U$2.COIL-
  Bottom 0.61: X1.5 70.2,13.75 70.2,44.2 83,57 95.5,57 98.6,53.9
  Bottom 1.27: 98.6,53.9 U$5.NOA2
N$2  (via drill 0.35)
  Top 0.2: +12V.C 167.95,105.05 v168.5,104.5
  Bottom 0.2: v168.5,104.5 169.3,103.7 LED_R1.2
N$3
  Bottom 0.254: R10.2 113.23,32.5 T1.B
N$4
  Bottom 0.508: 116.5,57 116.5,61 114.5,63 106.5,63 105,64.5 U$2.NCA4
  Bottom 1.27: U$2.NOA3 105,56 106,57 116.5,57 145.5,28 U$11.R2 150.06,27.98 U$11.R1
N$5  (via drill 0.35)
  Top 0.2: v58.5,34.5 57.05,34.5 +12V_.C
  Bottom 0.2: 58.27,35.68 LED_R4.2 58.5,35.45 v58.5,34.5
N$6  (via drill 0.35)
  Top 0.2: v52,33.5 49.55,33.5 +12V_SAFE.C
  Bottom 0.2: 52.52,30.75 LED_R2.2 52,31.55 v52,33.5
N$7
  Top 0.2: LED_R5.2 187.48,10.52 185.97,10.52 PRECHARGE_EN.C
N$8  (via drill 0.35)
  Top 0.2: v173.5,10 173.3,9.8 PRECHARGE_OK.C
  Bottom 0.2: LED_R3.2 173.5,10.8 v173.5,10
N$10
  Bottom 2.54: R12.1 R16.2
N$11  (via drill 0.35)
  Top 0.2: AMS_OK.C v82,22
  Bottom 0.2: v82,22 83.05,20.95 LED_R6.2
N$13  (via drill 0.35)
  Top 0.2: EXT1.C 101.7,24.2 v102.5,25
  Bottom 0.2: 103.8,25.25 LED_R7.2 103.25,25.75 v102.5,25
N$14  (via drill 0.35)
  Top 0.2: EXT2.C 92.5,24.45 v92.5,24.5
  Bottom 0.2: v92.5,24.5 93.25,23.75 LED_R8.2
N$15  (via drill 0.35)
  Top 0.2: v86.5,28.5 85.2,29.8 EXT_IN.C
  Bottom 0.2: LED_R9.2 86.5,26.55 v86.5,28.5
N$17
  Bottom 2.54: R13.1 R12.2
N$18
  Bottom 2.54: R14.1 R13.2
N$19
  Bottom 2.54: R15.1 R14.2
N$20
  Bottom 2.54: R21.2 R15.2
N$21
  Bottom 2.54: R21.1 R20.2
N$22
  Bottom 2.54: R20.1 165.8,143.5 R19.2
N$23
  Bottom 2.54: R19.1 167.5,154.3 R18.2
N$24
  Bottom 2.54: R18.1 175,156.2 R17.2
N$25
  Top 0.813: R2.2 R1.2 110.55,6.6 DIS_PRE_CHARGE_LV.6
N$26
  Top 2.54: X3.1 X3.2 134.9,154.25 131.9,151.25 127.9,151.25 123.4,146.75 114.9,146.75 99.65,131.5 INPUT_FUSE2.P$2 81.75,128.35 U$8.P$2 U$8.P$4
N$27
  Bottom 0.813: R3.2 81.05,36 85.77,36 T2.B
N$29
  Top 0.813: R5.2 105.88,28.95 U$12.1
N$30
  Top 0.813: R6.2 87.3,42.75 U$13.1
N$31
  Top 1.27: U$22.2 179.58,132.5 R7.2
N$32
  Bottom 2.54: R28.1 R27.2
N$33
  Bottom 2.54: R29.1 80,155.7 R28.2
N$34
  Bottom 2.54: R30.1 80,167.3 R29.2
N$35
  Bottom 2.54: R31.1 72,167.3 R30.2
N$36
  Bottom 2.54: R36.2 72,155.7 R31.2
N$37
  Bottom 2.54: R35.2 64,155.7 R36.1
N$38
  Bottom 2.54: R34.2 64,166.8 R35.1
N$39
  Bottom 2.54: R33.2 56,166.8 R34.1
N$40
  Bottom 2.54: R32.2 56,155.7 R33.1
N$41
  Top 1.27: +12V_SAFE1.A 172.3,135.35 R7.1
N$42
  Top 2.54: HVIB_LV.9 HVIB_LV.8 | HVIB_LV.9 HVIB_LV.10 | HVIB_LV.9 162.3,91.8 U$14.L2 U$14.L1
N$44
  pour Top: 129.5,147.5 129.5,128 137.5,128 137.5,147.5
PRECHARGE
  Bottom 1.27: AIR_N_LV.1 196.9,6.6 194.5,9 194.5,29.25 191.95,31.8 U$10.3
PRECHARGE_EN
  Top 0.2: U$10.4 183.5,8.5 PRECHARGE_EN.A
  Top 0.813: X1.2 59.1,10.41 61.44,8.07 61.44,5.37 63.81,3 106.55,3 108.05,4.5 R1.1 108.05,4.45 108.5,4 113.66,4 114.48,4.82 119.4,4.82 121.67,2.55 171,2.55 179,10.55 U$10.4
PRECHARGE_OK
  Top 0.813: X1.3 63.3,10.25 65.14,8.41 65.14,5.87 66,5.01 66,5 66.5,4.5 103.5,4.5 107.5,8.5 | 168.5,9 168.5,6 166.52,4.02 128.98,4.02 124.5,8.5 114,8.5 112.5,10 108.5,10 108.05,9.55 108.05,9 | 168.5,9 168.5,12 169.5,13 U$9.4 | PRECHARGE_OK.A 168.75,8.75 168.5,9 | 107.5,8.5 R2.1 108.05,9 | 107.5,8.5 108,9 108.05,9
SAF_EXT_IN
  Top 0.2: EXT_IN.A 87.44,24.55 87.45,24.55
  Top 0.61: U$13.8 87.45,24.55 84.3,21.39 X1.8
SAF_MAIN
  Top 1.27: U$5.NOA3 93.45,51.5 102.45,51.5 U$2.NOB3
SAF_MAIN_OUT
  Top 1.27: U$5.NOB3 71.45,48.95 67.5,45 X1.4
TSAL_GRN_GND
  Bottom 0.61: X1.14 61,8.65 61,33 64.5,36.5 64.5,46.5 87,69 121,69 152.2,100.2 HVIB_LV.2
TSAL_RED_GND
  Bottom 0.61: X1.15 65.5,8.95 65.5,46 87.5,68 122.25,68 150.25,96 HVIB_LV.3
TSMP+
  Bottom 2.54: R16.1 103.6,143.4 X2.2
TSMP-
  Bottom 2.54: R27.1 98.25,152.05 X2.1
V+
  Top 1.27: U$22.3 202,150.44 202,166.5
  Top 2.54: AIR_P_HV.1 31.9,173.4 26.5,168 26.5,153 32.5,147 INPUT_FUSE1.P$2 | U$7.P$4 U$7.P$2 71.25,141.5 | U$8.P$1 U$8.P$3 71.25,129.15 INPUT_FUSE2.P$1
  Top 3: AIR_P_HV.1 AIR_P_HV.6 DIS_PRE_CHARGE_HV.10 DIS_PRE_CHARGE_HV.5 HVIB_HV.1 | HVIB_HV.6 HVIB_HV.7 HVIB_HV.2 HVIB_HV.1 | HVIB_HV.6 HVIB_HV.1 | AIR_N_HV.10 AIR_N_HV.5 AIR_N_HV.4 AIR_N_HV.9 AIR_N_HV.10 | HVIB_HV.6 AIR_N_HV.10 | INPUT_FUSE1.P$2 71.25,141.5 INPUT_FUSE2.P$1
  Bottom 2.54: 188.7,169.2 AIR_N_HV.9 179.4,169.2 R17.1
  pour Top: 24.5,165.5 203.5,165.5 203.5,177.5 24.5,177.5
  pour Top (rank 3): 74.5,123 74.5,168.5 24.5,168.5 24.5,122.5 74,122.5
V-
  Top 3: AIR_P_HV.10 AIR_P_HV.9 AIR_P_HV.4 AIR_P_HV.5 AIR_P_HV.10 | AIR_P_HV.10 DIS_PRE_CHARGE_HV.6 DIS_PRE_CHARGE_HV.1 128.25,156.6 131.9,160.25 X3.4 X3.3
  Bottom 2.54: AIR_P_HV.10 47.1,156.6 R32.1
  pour Top (rank 2): 34.5,163.5 151.5,163.5 151.5,153 34.5,153
(copper drawn outside any net)
  shapes: Top area x1

### Text on the board
tNames: DCDC | IMD HV | HVIB | HV-_AUX | TSMP- | AIR-, DISCHARGE | TSMP+ | AIR+, PRECHARGE | EM+ | ACCUMULATOR MOTHERBOARD REV3, BUILD1. CONTACT: ANDREW RANDELL | WESTERN FORMULA RACING | HIGH VOLTAGE 60~600V | LOW VOLTAGE <60V | HVIB | WESTERN / FORMULA / RACING | AIR+, PRECHARGE | AIR-, DISCHARGE | DCDC | SAF 12V FUSE | bottom row: / 13: ACC LIGHT / 14: TSAL GREEN / 15: TSAL RED / 16: IMD DATA / 17: IMD DATA / 18: NC / 19,20:AMS +12V / ...: GND | IMD 12V FUSE | top row: / 1: +12V SAFE / 2: PRECHARGE EN / 3: PRECHARGE OK / 4: SAF MAIN OUT / 5: EXT RST1 / 6: EXT RST2 / 7: AMS OK / 8: SAF EXT IN / 9: EXT FAULT LED / 10, 11, 12: +12V | IMD 12V | IMD HS | PRE | EN | IMD LV | LV CONN 24 | IMD STATUS | IMD LS | OK | WFR-FSAE / 2019-2020
_tsilk: Main / Fuse